# EasyEDA schematic Colpitt's Oscillator.json
TITLE: Colpitt's using SAW; REV: 1.0; Date: 2024-01-08; Sheet: 1/1; Company: Mrxt
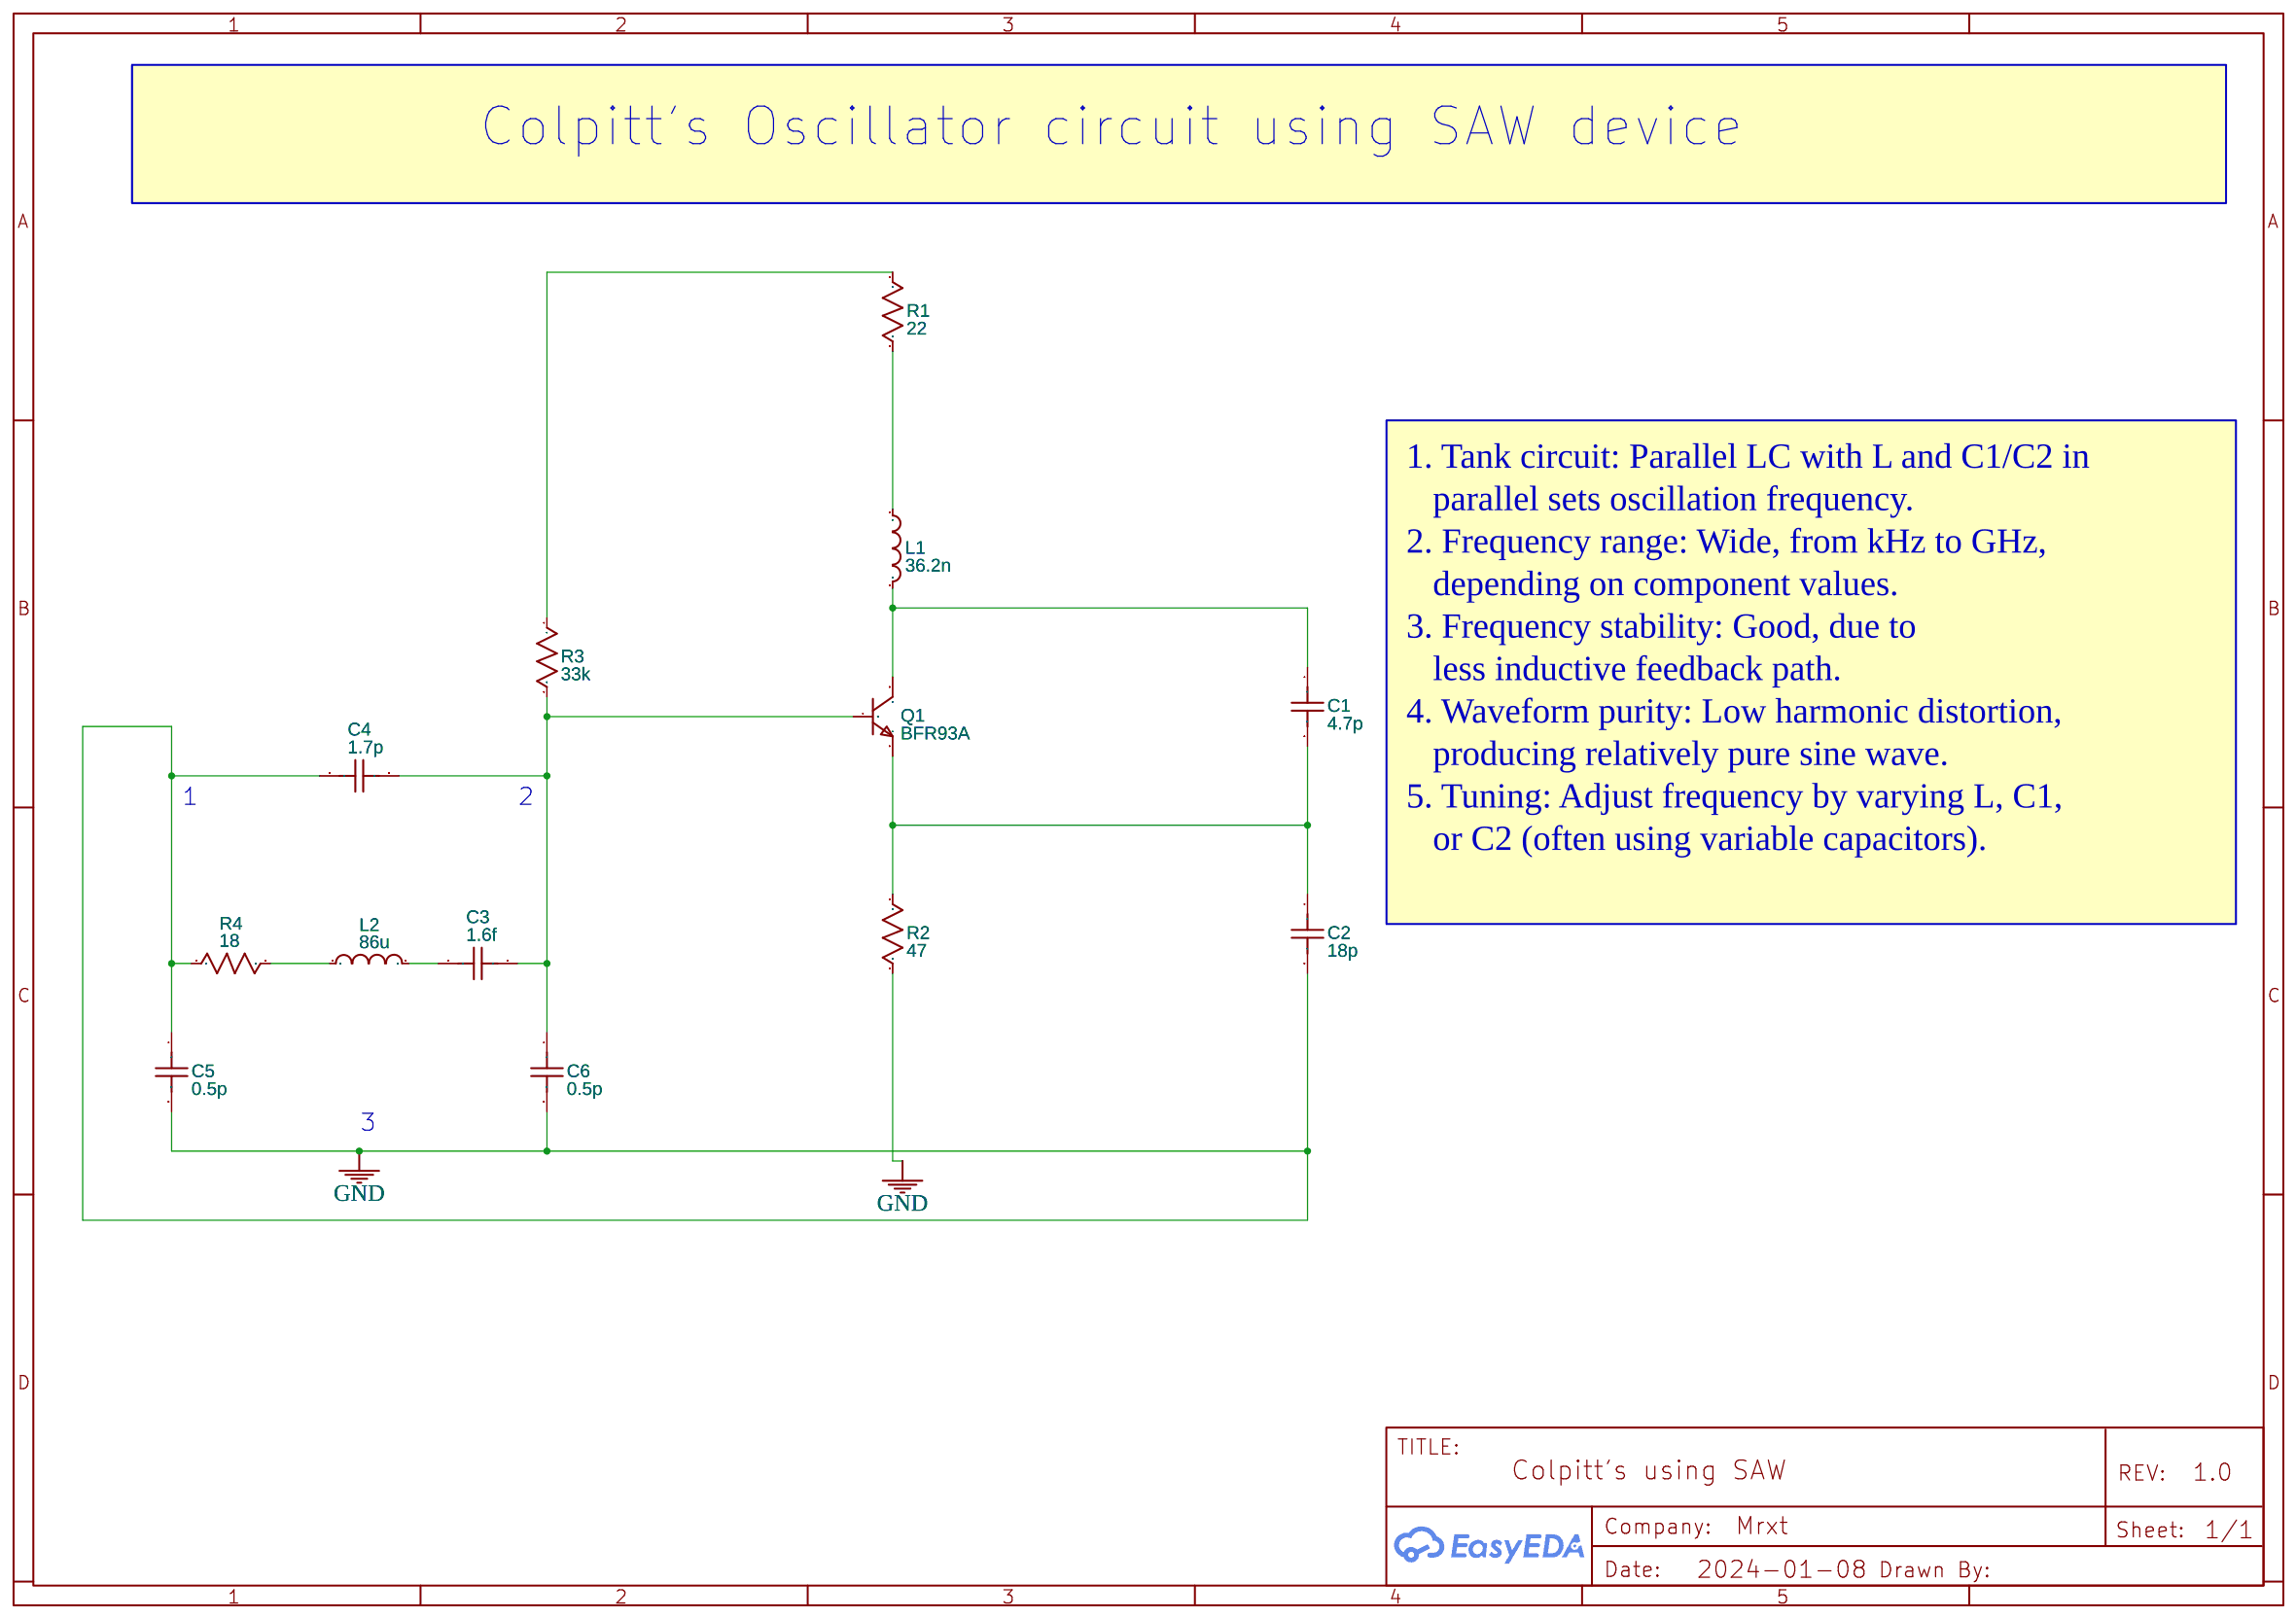
[diagram p0: schematic sheet]

## Parts
C1  4.7p  [C0402]
C2  18p  [C0402]
C3  1.6f  [C0402]
C4  1.7p  [C0402]
C5  0.5p  [C0402]
C6  0.5p  [C0402]
L1  36.2n  [L0402]
L2  86u  [L0402]
Q1  BFR93A  [SOT-323-3_L2.0-W1.3-P1.30-LS2.1-BR]
R1  22  [R0402]
R2  47  [R0402]
R3  33k  [R0402]
R4  18  [R0402]

## Library data of the parts
C1-C6 = C_0402_US: Contributor: LCEDA_Lib
L1 L2 = L0402_US: Contributor: LCEDA_Lib
Q1 = BFR93AWH6327XTSA1: Contributor: LCSC; Supplier Part: C151481; Supplier: LCSC; Manufacturer: Infineon(英飞凌); Manufacturer Part: BFR93AWH6327; JLCPCB Part Class: Extended Part
R1-R4 = R_0402_US: Contributor: LCEDA_Lib

## Nets
GND: C2.2 C4.1 C5.1 C5.2 C6.2 R2.2 R4.1
Net-(C1-1): C1.1 L1.2 Q1.3(C)
Net-(C1-2): C1.2 C2.1 Q1.2(E) R2.1
Net-(C3-1): C3.1 L2.2
Net-(C3-2): C3.2 C4.2 C6.1 Q1.1(B) R3.2
Net-(L1-1): L1.1 R1.2
Net-(L2-1): L2.1 R4.2
Net-(R1-1): R1.1 R3.1

## Notes on the sheet
- Colpitt's Oscillator circuit using SAW device
- 1. Tank circuit: Parallel LC with L and C1/C2 in
     parallel sets oscillation frequency.
  2. Frequency range: Wide, from kHz to GHz,
     depending on component values.
  3. Frequency stability: Good, due to
     less inductive feedback path.
  4. Waveform purity: Low harmonic distortion,
     producing relatively pure sine wave.
  5. Tuning: Adjust frequency by varying L, C1,
     or C2 (often using variable capacitors).
- 1
- 2
- 3
